# Altium schematic sheet MCU_Controller.SchDoc
size A4; Organization: Q-Tech Design; Address1: Da Nang City; Address2: Viet Nam; DocumentNumber: 2; SheetNumber: 2; SheetTotal: 7
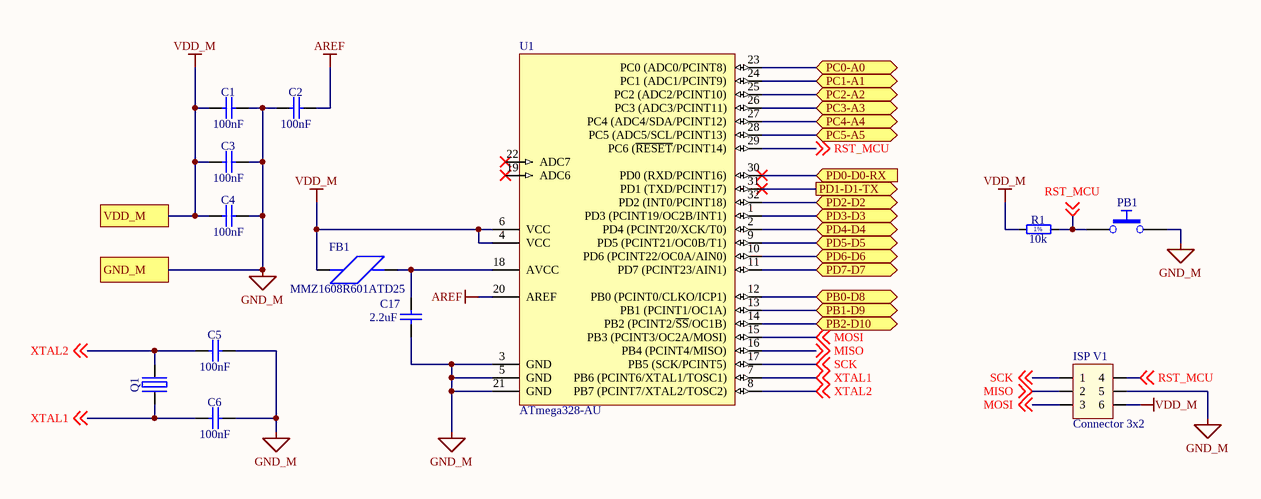
[diagram p0: MCU_Controller.SchDoc]

## Parts
C1  100nF  [CAPC1608X87N]
C2  100nF  [CAPC1608X87N]
C3  100nF  [CAPC1608X87N]
C4  100nF  [CAPC1608X87N]
C5  100nF  [CAPC1608X87N]
C6  100nF  [CAPC1608X87N]
C17  2.2uF  [CAPC1608X87N]
FB1  Manufacturer Part Number: MMZ1608R601ATD25  [Chip_0603]  (hidden comment: Ferrite bead Case 0603)
ISP_V1  Connector 3x2  [JP3x2]
PB1  Push Button  [PB_TYCO_FSMSM]  (value not drawn)
Q1  20MHz  [XTAL_HC-49/U]  (value not drawn)
R1  10k  [RESC1608X55N]
U1  ATmega328-AU  [32A_ATM-M]

## Ports
GND_M, PB0-D8 (bidir), PB1-D9 (bidir), PB2-D10 (bidir), PC0-A0 (bidir), PC1-A1 (bidir), PC2-A2 (bidir), PC3-A3 (bidir), PC4-A4 (bidir), PC5-A5 (bidir), PD0-D0-RX (in), PD1-D1-TX (out), PD2-D2 (bidir), PD3-D3 (bidir), PD4-D4 (bidir), PD5-D5 (bidir), PD6-D6 (bidir), PD7-D7 (bidir), VDD_M

## Nets
AREF: C2.2 U1.20(AREF)
GND_M: C1.2 C2.1 C3.2 C4.2 C5.2 C6.2 C17.1 ISP_V1.5 PB1.2 U1.3(GND) U1.5(GND) U1.21(GND) ; port GND_M
VDD_M: C1.1 C3.1 C4.1 FB1.1 ISP_V1.6 R1.1 U1.4(VCC) U1.6(VCC) ; port VDD_M
MISO: ISP_V1.2 U1.16(PB4_(PCINT4/MISO)) ; off-sheet MISO
MOSI: ISP_V1.3 U1.15(PB3_(PCINT3/OC2A/MOSI)) ; off-sheet MOSI
PB0-D8: U1.12(PB0_(PCINT0/CLKO/ICP1)) ; port PB0-D8
PB1-D9: U1.13(PB1_(PCINT1/OC1A)) ; port PB1-D9
PB2-D10: U1.14(PB2_(PCINT2/~{SS}/OC1B)) ; port PB2-D10
PC0-A0: U1.23(PC0_(ADC0/PCINT8)) ; port PC0-A0
PC1-A1: U1.24(PC1_(ADC1/PCINT9)) ; port PC1-A1
PC2-A2: U1.25(PC2_(ADC2/PCINT10)) ; port PC2-A2
PC3-A3: U1.26(PC3_(ADC3/PCINT11)) ; port PC3-A3
PC4-A4: U1.27(PC4_(ADC4/SDA/PCINT12)) ; port PC4-A4
PC5-A5: U1.28(PC5_(ADC5/SCL/PCINT13)) ; port PC5-A5
PD0-D0-RX: U1.30(PD0_(RXD/PCINT16)) ; port PD0-D0-RX
PD1-D1-TX: U1.31(PD1_(TXD/PCINT17)) ; port PD1-D1-TX
PD2-D2: U1.32(PD2_(INT0/PCINT18)) ; port PD2-D2
PD3-D3: U1.1(PD3_(PCINT19/OC2B/INT1)) ; port PD3-D3
PD4-D4: U1.2(PD4_(PCINT20/XCK/T0)) ; port PD4-D4
PD5-D5: U1.9(PD5_(PCINT21/OC0B/T1)) ; port PD5-D5
PD6-D6: U1.10(PD6_(PCINT22/OC0A/AIN0)) ; port PD6-D6
PD7-D7: U1.11(PD7_(PCINT23/AIN1)) ; port PD7-D7
RST_MCU: ISP_V1.4 PB1.1 R1.2 U1.29(PC6_(~{RESET}/PCINT14)) ; off-sheet RST_MCU
SCK: ISP_V1.1 U1.17(PB5_(SCK/PCINT5)) ; off-sheet SCK
XTAL1: C6.1 Q1.1(OSC1) U1.7(PB6_(PCINT6/XTAL1/TOSC1)) ; off-sheet XTAL1
XTAL2: C5.1 Q1.2(OSC2) U1.8(PB7_(PCINT7/XTAL2/TOSC2)) ; off-sheet XTAL2
NetC17_2: C17.2 FB1.2 U1.18(AVCC)

Not connected (* = marked no-connect by the designer): U1 19(ADC6)* 22(ADC7)*

## Notes on the sheet
- Page Title:
- Date:
- Title:
- DRE:
- Time:
- Number:
- Sheet
- Rev:
- of
- Q-Tech confidential and proprietary. Restricted access under NDA. Do not reproduce. Store and dispose securely.
- (in symbol R0603_10K_1%_0.1W_100PPM) 1%

## Library data of the parts
C1-C4 = CC0603_100NF_50V_10%_X7R: Non-polarised capacitor; Part Description: SMD Multilayer Chip Ceramic Capacitor; Manufacturer: GENERIC; Manufacturer1 Part Number: 223858615649; Voltage: 50V; TC: X7R; Tolerance: ±10%; Table: Capacitors SMD; Part Number: CC0603_100NF_50V_10%_X7R; Component Kind: Standard; Component Type: Standard; Pin Count: 2; Value: 100nF; Status: Preferred; Manufacturer Part Number: CC0603_100NF_50V_10%_X7R; Case: 0603; Mounted: Yes; Socket: No; SMD: Yes; Manufacturer1 Example: PHYCOMP; Manufacturer1 ComponentHeight: 0.87mm; HelpURL: \\cern.ch\dfs\Applications\Altium\Datasheets\CC0603_X7R_PHYCOMP.pdf; Author: CERN DEM JLC; CreateDate: 03-Dec-07; LatestRevisionDate: 03-Dec-07
C5 C6 = CC0603_22PF_50V_5%_NP0: Non-polarised capacitor; Part Description: SMD Multilayer Chip Ceramic Capacitor; Manufacturer: GENERIC; Manufacturer1 Part Number: 223886715229; Value: 22pF; Voltage: 50V; TC: NP0; Tolerance: ±5%; Table: Capacitors SMD; Part Number: CC0603_22PF_50V_5%_NP0; Component Kind: Standard; Component Type: Standard; Pin Count: 2; Status: Preferred; Manufacturer Part Number: CC0603_22PF_50V_5%_NP0; Case: 0603; Mounted: Yes; Socket: No; SMD: Yes; Manufacturer1 Example: PHYCOMP; Manufacturer1 ComponentHeight: 0.87mm; HelpURL: \\cern.ch\dfs\Applications\Altium\Datasheets\CC0603_NP0_PHYCOMP.pdf; Author: CERN DEM JLC; CreateDate: 03-Dec-07; LatestRevisionDate: 03-Dec-07
C17 = CC0603_2.2UF_16V_10%_X5R: Non-polarised capacitor; Part Description: SMD Multilayer Chip Ceramic Capacitor; Manufacturer: GENERIC; Manufacturer1 Part Number: CC0603KRX5R7BB225; Voltage: 16V; TC: X5R; Tolerance: ±10%; Table: Capacitors SMD; Part Number: CC0603_2.2UF_16V_10%_X5R; Component Kind: Standard; Component Type: Standard; Pin Count: 2; Value: 2.2uF; Status: Preferred; Manufacturer Part Number: CC0603_2.2UF_16V_10%_X5R; Case: 0603; Mounted: Yes; Socket: No; SMD: Yes; Manufacturer1 Example: YAGEO; Manufacturer1 ComponentHeight: 0.9mm; HelpURL: \\cern.ch\dfs\Applications\Altium\Datasheets\CC0805_X5R_PHYCOMP_HC.pdf; Author: CERN DEM JLC; CreateDate: 28-Apr-11; LatestRevisionDate: 28-Apr-11
FB1 = FERRITE_0603
ISP_V1 = JP3x2: Value: Connector 3x2
PB1 = PB SPST 1NO-2NO: Push-Button Switch SPDT; Part Description: 12VDC 50mA SPST Tactile  Push-Button Switch; Manufacturer: TYCO ELECTRONICS; Manufacturer Part Number: FSMSM or 1437566-3; Table: Switches; Part Number: PB_TYCO_FSMSM; Component Kind: Standard; Component Type: Standard; Pin Count: 2; PackageDescription: Body 3.5x6.0mm, Pushbutton Switch,  TYCO ALCOSWITCH FSMSM Serie; Family: Push Button; Mounted: Yes; Socket: No; SMD: Yes; Status: None; ComponentHeight: 4.3mm; HelpURL: \\cern.ch\dfs\Applications\Altium\Datasheets\PB_TYCO_FSMSM.pdf; Author: CERN DEM JLC; CreateDate: 6/30/2008; LatestRevisionDate: 6/21/2012
Q1 = XTAL_20MHZ_AEL_HC-49/U: Quartz Crystal; Part Description: ±30ppm Quartz Crystal Resonator, HC-49/U Type; Manufacturer: AEL CRYSTALS; Manufacturer Part Number: X20M000000L010; Table: Crystals & Oscillators; Part Number: XTAL_20MHZ_AEL_HC-49/U; Component Kind: Standard; Component Type: Standard; PackageDescription: HC-49/U Leaded Cristal, Body 11.05x4.8mm; Pitch 4.88mm; Value: 20MHz; Pin Count: 2; Mounted: Yes; Socket: No; SMD: No; ComponentHeight: 13.6mm; HelpURL: \\cern.ch\dfs\Applications\Altium\Datasheets\XTAL_AEL_HC-49-U.pdf; Author: CERN DEM JMW; CreateDate: 31-Oct-08; LatestRevisionDate: 13-May-11
R1 = R0603_10K_1%_0.1W_100PPM: Resistor - 1%; Part Description: General Purpose Thick Film Chip Resistor; Manufacturer: GENERIC; Manufacturer1 Part Number: NRC06F1002TRF; Power: 0.1W; TC: ±100ppm/°C; Table: Resistors SMD; Part Number: R0603_10K_1%_0.1W_100PPM; Component Kind: Standard; Component Type: Standard; Pin Count: 2; Value: 10k; Status: Preferred; Tolerance: ±1%; Manufacturer Part Number: R0603_10K_1%_0.1W_100PPM; Case: 0603; Mounted: Yes; Socket: No; SMD: Yes; Manufacturer1 Example: NIC COMPONENT; Manufacturer1 ComponentHeight: 0.55mm; HelpURL: \\cern.ch\dfs\Applications\Altium\Datasheets\R0603_NIC_NRC.pdf; Author: CERN DEM JLC; CreateDate: 03-Dec-07; LatestRevisionDate: 13-Mar-08
U1 = ATmega328-AU: 8-bit AVR Microcontroller, 32KB Flash, 1KB EEPROM, 2KB SRAM, 32-pin TQFP, Industrial Grade (-40°C to 85°C); Published: 1-Apr-2010; DatasheetVersion: revA, Jan-2010; PackageVersion: revB, Oct-2001; PackageReference: 32A; Publisher: Altium Limited; PackageDescription: 32-Lead, 7x7x1.0 mm Body, 0.8mm Lead Pitch, Thin Profile Plastic Quad Flat Package (TQFP); Supplier 1: Digi-Key; Supplier Part Number 1: ATMEGA328-AU-ND; Supplier 2: Mouser; Supplier Part Number 2: 556-ATMEGA328-AU; Code_JEDEC: MS-026-ABA; ComponentLink1Description: Manufacturer Link; ComponentLink1URL: http://www.atmel.com/products/avr/default.asp?; ComponentLink2Description: ATmega48A/48PA/88A/88PA/168A/168PA/328/328P Datasheet; ComponentLink2URL: http://www.atmel.com/dyn/resources/prod_documents/8271.pdf; ComponentLink3Description: ATmega48A/48PA/88A/88PA/168A/168PA/328/328P Summary; ComponentLink3URL: http://www.atmel.com/dyn/resources/prod_documents/8271S.pdf; ComponentLink4Description: Atmel.com Home; ComponentLink4URL: http://www.atmel.com